# Altium schematic sheet Sheet1.SchDoc
size OrCAD D; SheetNumber: 1; SheetTotal: 1
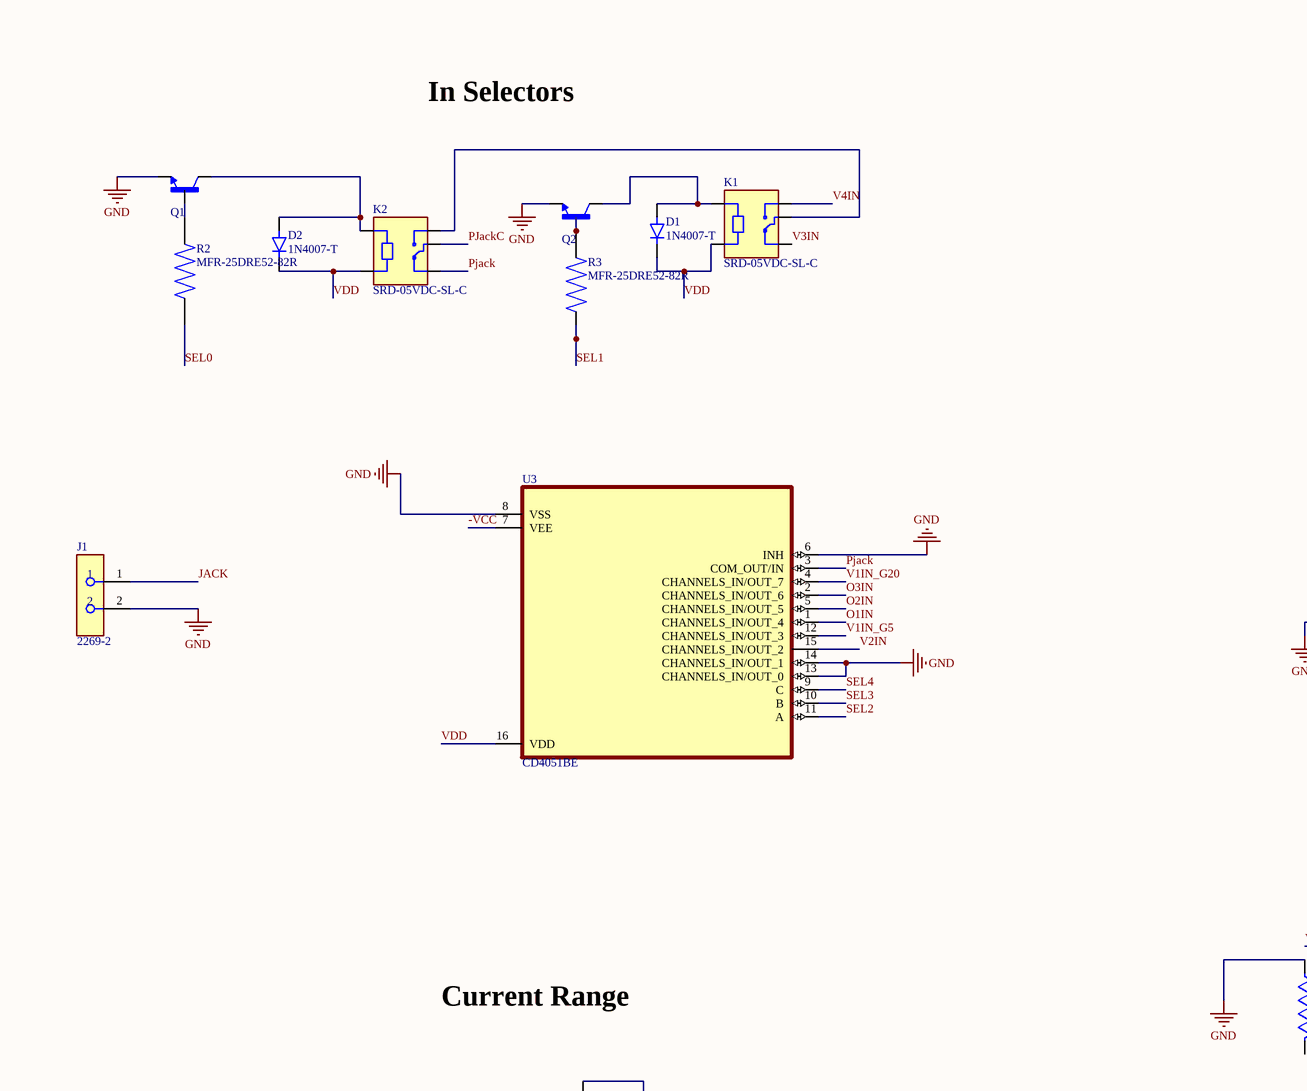
[diagram p0: Sheet1.SchDoc, top left]
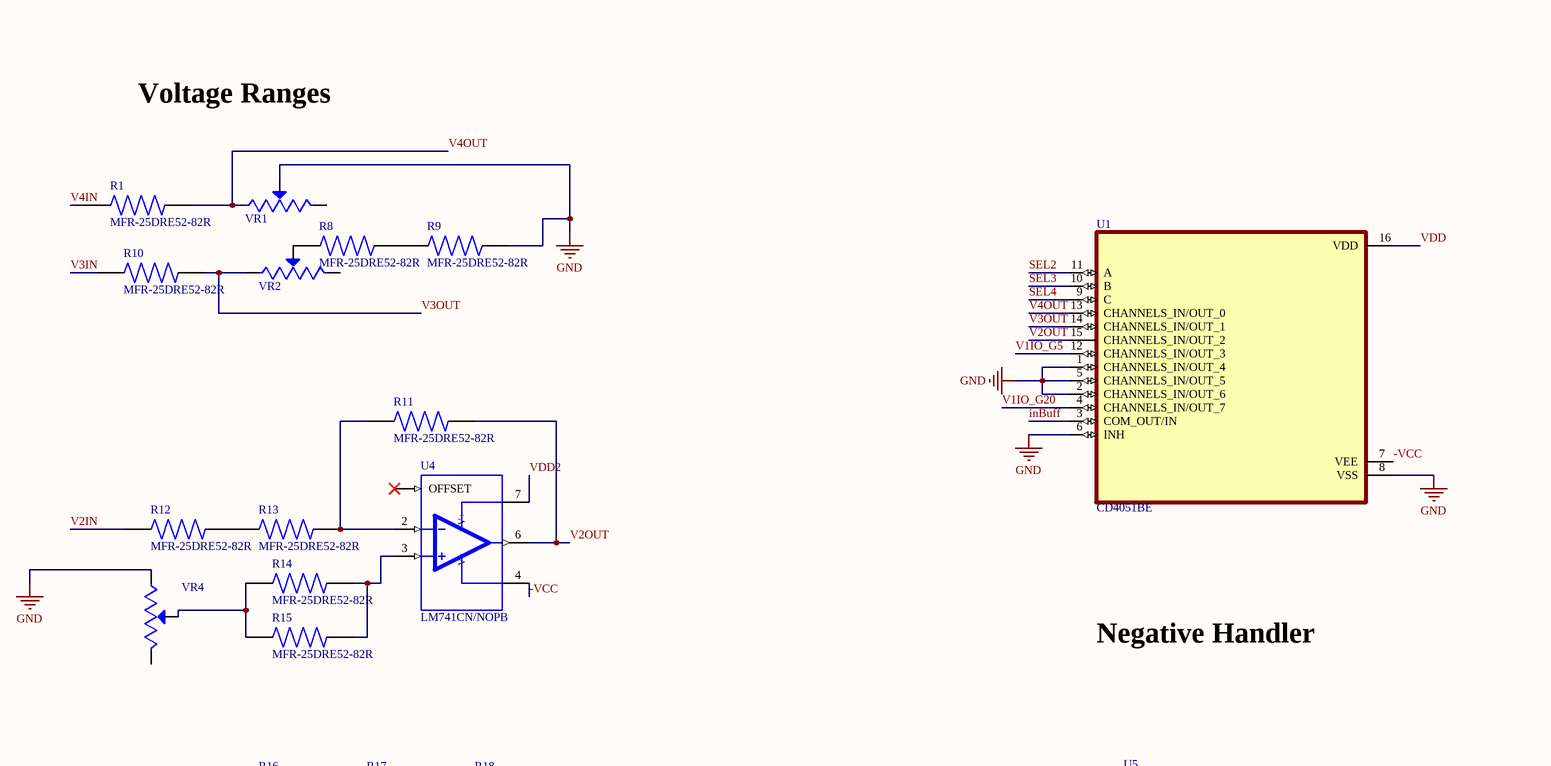
[diagram p1: Sheet1.SchDoc, top middle]
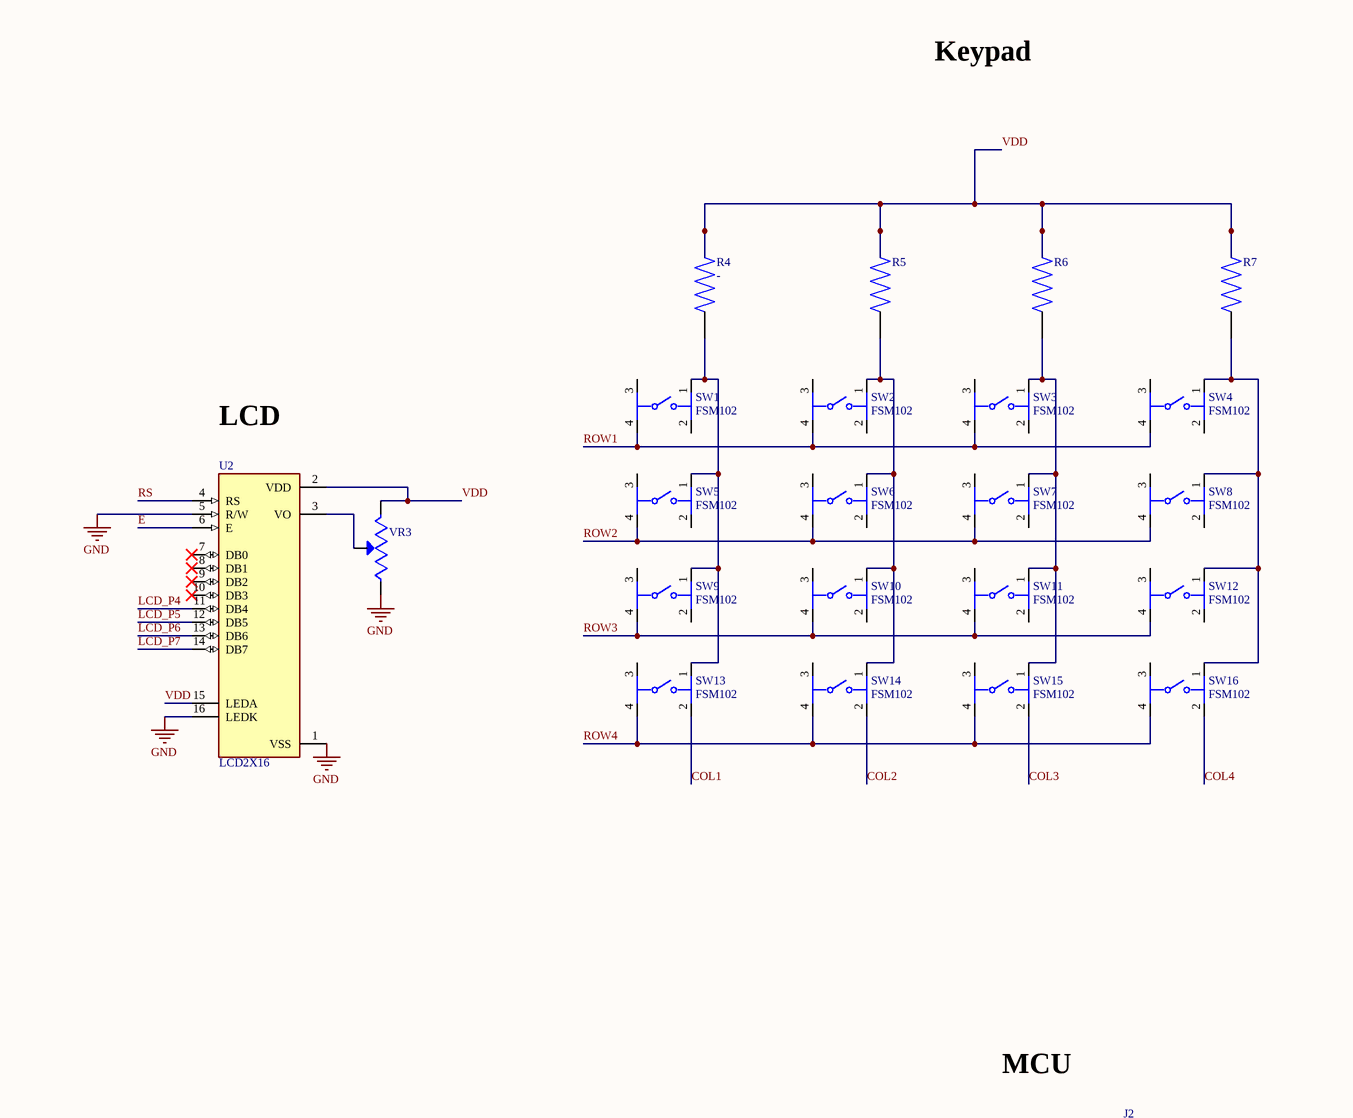
[diagram p2: Sheet1.SchDoc, top right]
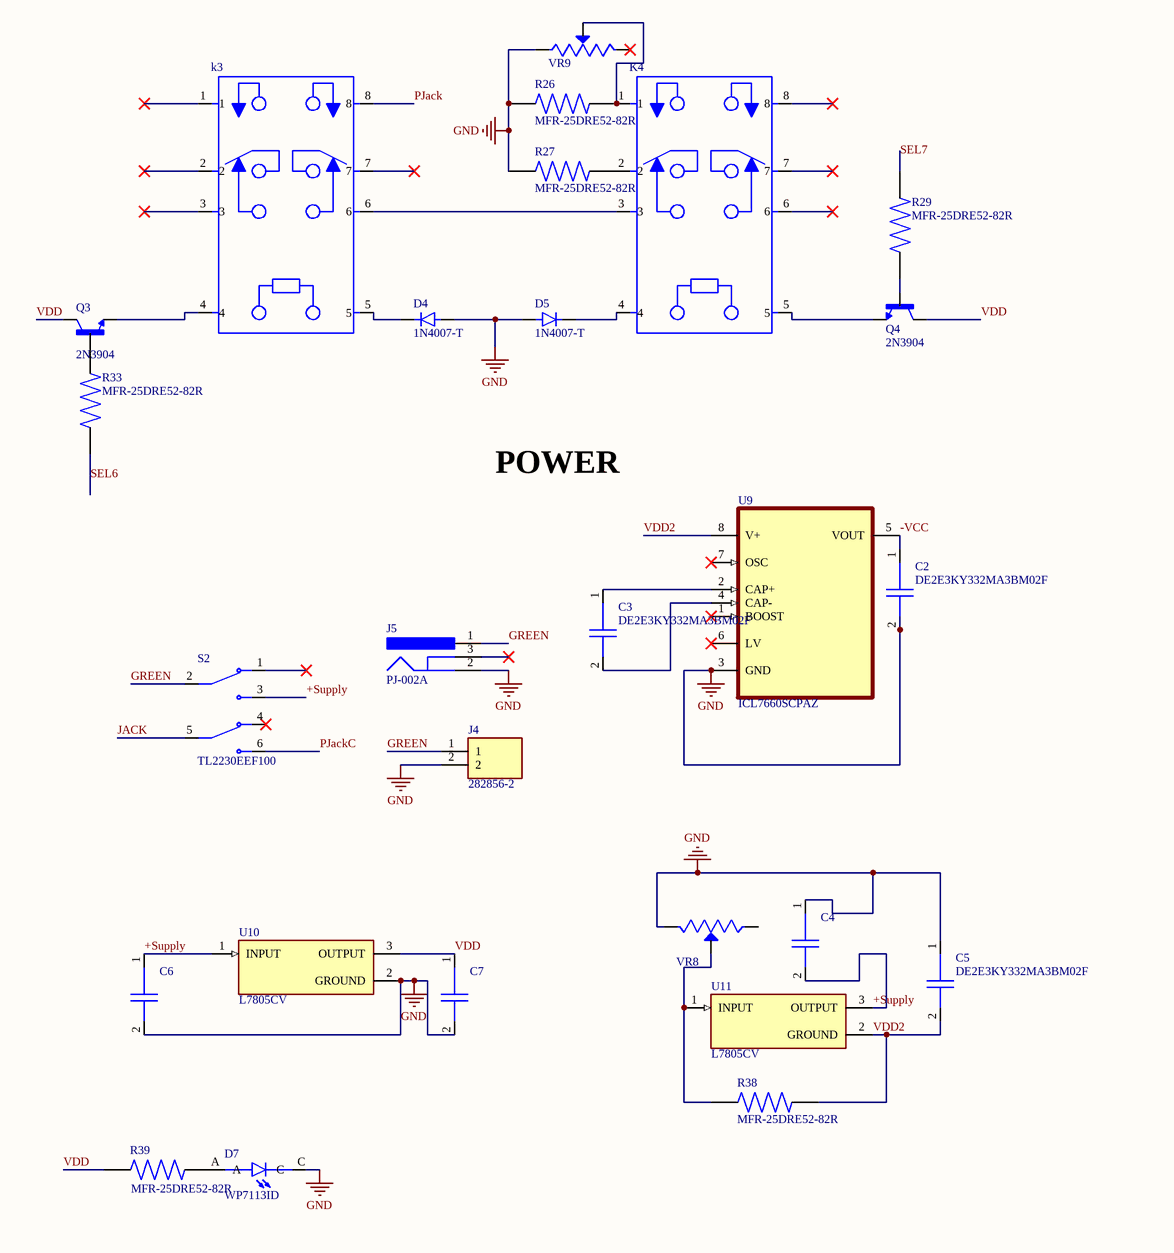
[diagram p3: Sheet1.SchDoc, bottom left]
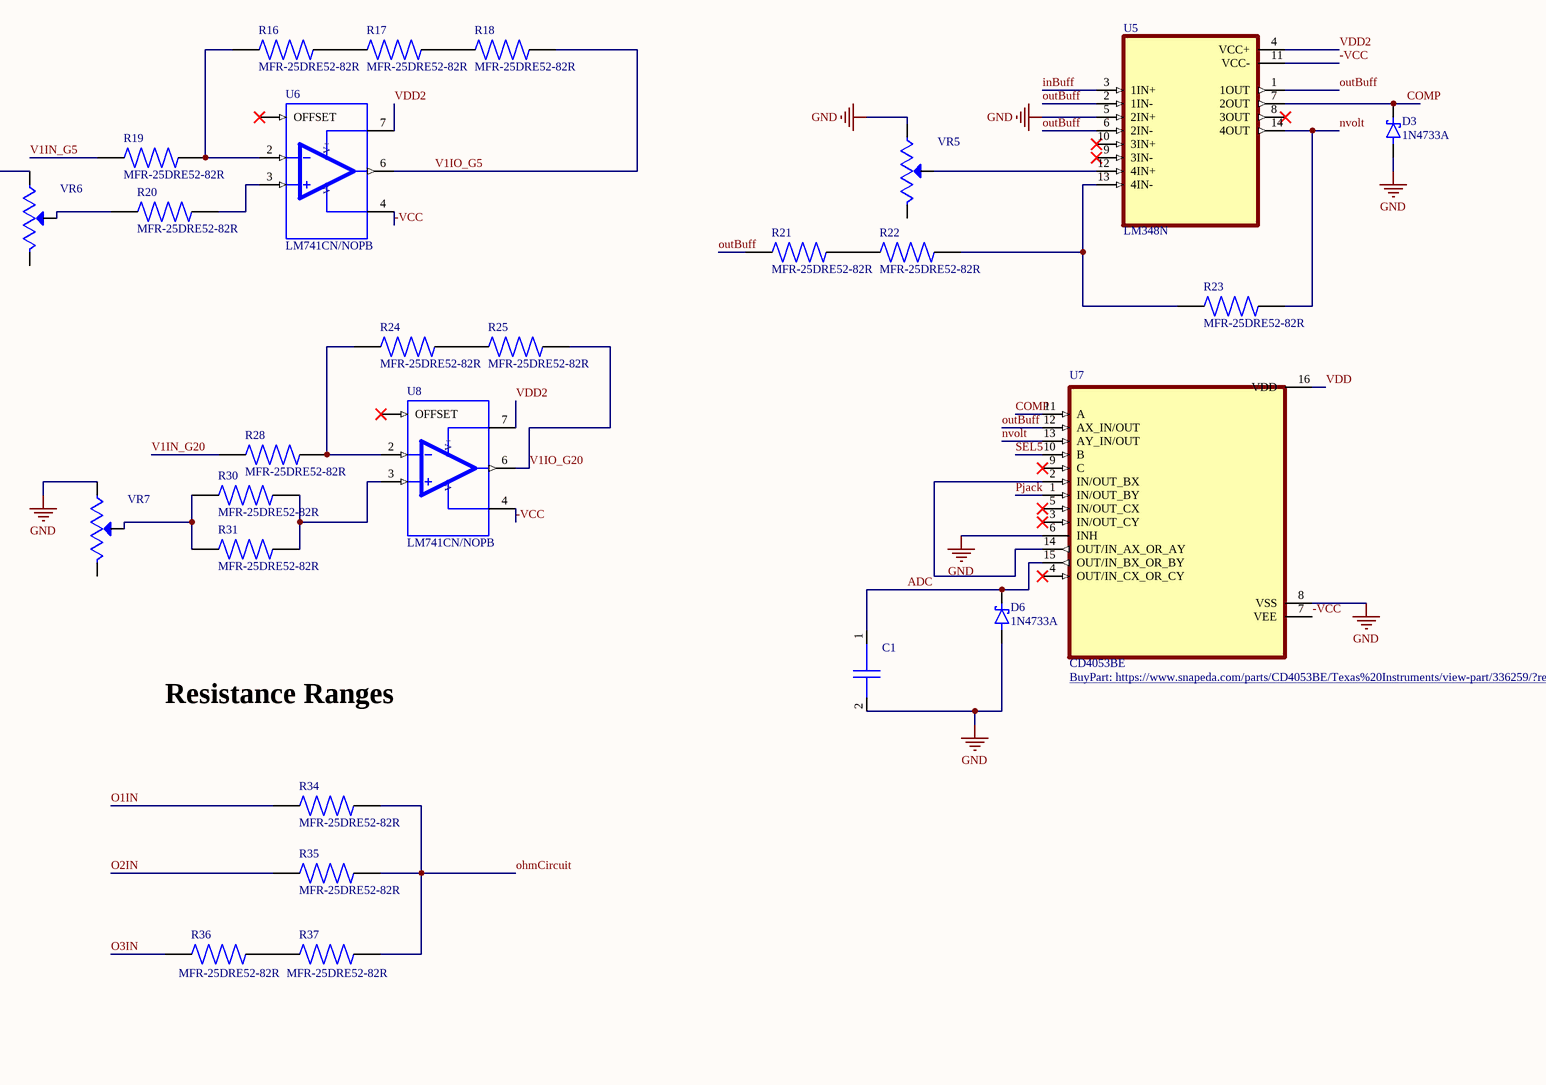
[diagram p4: Sheet1.SchDoc, bottom middle]
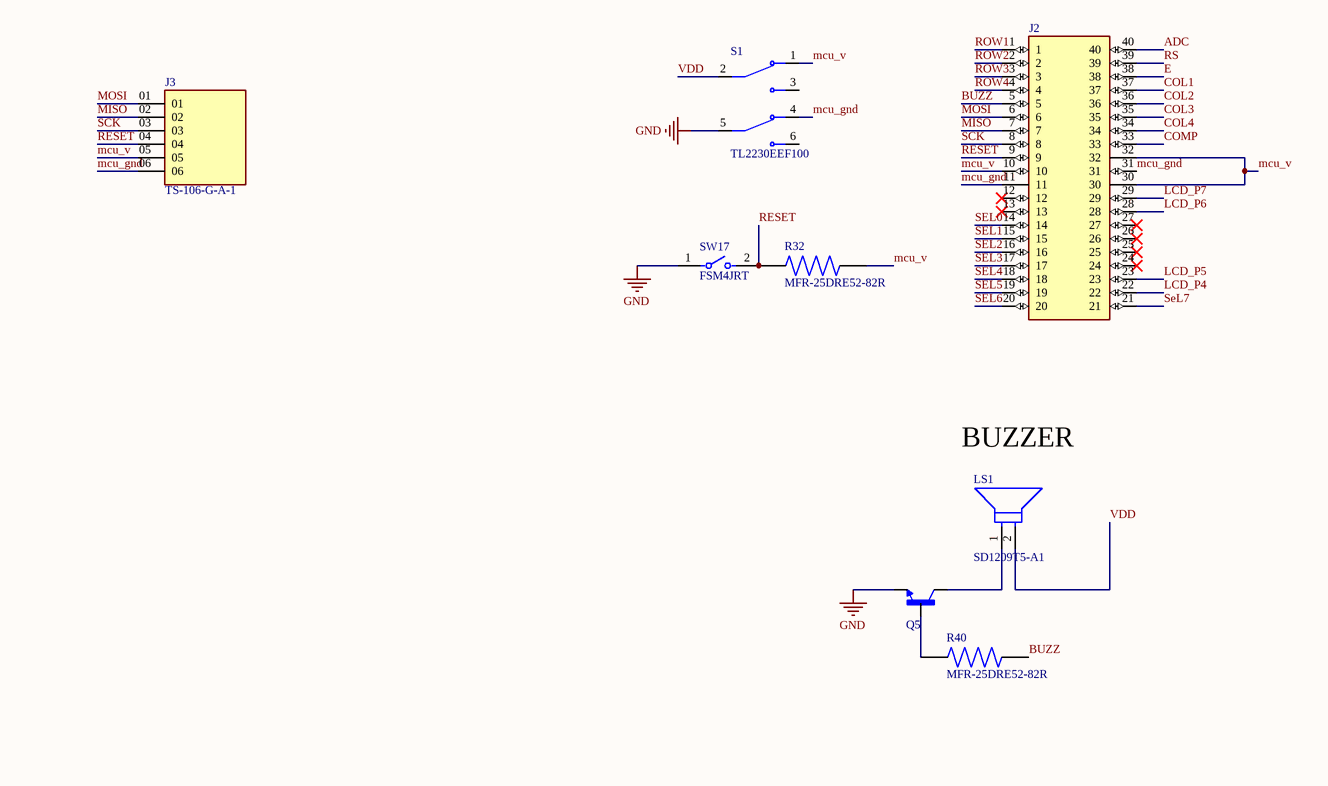
[diagram p5: Sheet1.SchDoc, bottom right]

## Parts
C1  DE2E3KY332MA3BM02F  [CAPRR750W60L900T500H900B]  (value not drawn)
C2  DE2E3KY332MA3BM02F  [CAPRR750W60L900T500H900B]
C3  DE2E3KY332MA3BM02F  [CAPRR750W60L900T500H900B]
C4  DE2E3KY332MA3BM02F  [CAPRR750W60L900T500H900B]  (value not drawn)
C5  DE2E3KY332MA3BM02F  [CAPRR750W60L900T500H900B]
C6  DE2E3KY332MA3BM02F  [CAPRR750W60L900T500H900B]  (value not drawn)
C7  DE2E3KY332MA3BM02F  [CAPRR750W60L900T500H900B]  (value not drawn)
D1  1N4007-T  [DIOAD780W78L463D236]
D2  1N4007-T  [DIOAD780W78L463D236]
D3  1N4733A  [DIOAD1036W78L463D272]
D4  1N4007-T  [DIOAD780W78L463D236]
D5  1N4007-T  [DIOAD780W78L463D236]
D6  1N4733A  [DIOAD1036W78L463D272]
D7  WP7113ID  [LED_WP7113ID]
J1  2269-2  [FP-2269-2-MFG]
J2  (no value)  [TE_3-1571552-2]
J3  TS-106-G-A-1  [SAMTEC_TS-106-G-A-1]
J4  282856-2  [TE_282856-2]
J5  PJ-002A  [CUI-PJ-002A_V]
K1  SRD-05VDC-SL-C  [RELAY_SRD-05VDC-SL-C]
K2  SRD-05VDC-SL-C  [RELAY_SRD-05VDC-SL-C]
k3  RELAY-HLS-14F3L-DC12V-C(8P-29.2X12.4MM)  [Relay (HLS-4078-DC5V)]  (value not drawn)
K4  RELAY-HLS-14F3L-DC12V-C(8P-29.2X12.4MM)  [Relay (HLS-4078-DC5V)]  (value not drawn)
LS1  SD1209T5-A1  [FP-SD1209-MFG]
Q1  2N3904  [TO92127P495H495-3]  (value not drawn)
Q2  2N3904  [TO92127P495H495-3]  (value not drawn)
Q3  2N3904  [TO92127P495H495-3]
Q4  2N3904  [TO92127P495H495-3]
Q5  2N3904  [TO92127P495H495-3]  (value not drawn)
R1  MFR-25DRE52-82R  [RESAD1520W70L1030D380]
R2  MFR-25DRE52-82R  [RESAD1520W70L1030D380]
R3  MFR-25DRE52-82R  [RESAD1520W70L1030D380]
R4  -  [RESAD1520W70L1030D380]
R5  (no value)  [RESAD1520W70L1030D380]
R6  (no value)  [RESAD1520W70L1030D380]
R7  (no value)  [RESAD1520W70L1030D380]
R8  MFR-25DRE52-82R  [RESAD1520W70L1030D380]
R9  MFR-25DRE52-82R  [RESAD1520W70L1030D380]
R10  MFR-25DRE52-82R  [RESAD1520W70L1030D380]
R11  MFR-25DRE52-82R  [RESAD1520W70L1030D380]
R12  MFR-25DRE52-82R  [RESAD1520W70L1030D380]
R13  MFR-25DRE52-82R  [RESAD1520W70L1030D380]
R14  MFR-25DRE52-82R  [RESAD1520W70L1030D380]
R15  MFR-25DRE52-82R  [RESAD1520W70L1030D380]
R16  MFR-25DRE52-82R  [RESAD1520W70L1030D380]
R17  MFR-25DRE52-82R  [RESAD1520W70L1030D380]
R18  MFR-25DRE52-82R  [RESAD1520W70L1030D380]
R19  MFR-25DRE52-82R  [RESAD1520W70L1030D380]
R20  MFR-25DRE52-82R  [RESAD1520W70L1030D380]
R21  MFR-25DRE52-82R  [RESAD1520W70L1030D380]
R22  MFR-25DRE52-82R  [RESAD1520W70L1030D380]
R23  MFR-25DRE52-82R  [RESAD1520W70L1030D380]
R24  MFR-25DRE52-82R  [RESAD1520W70L1030D380]
R25  MFR-25DRE52-82R  [RESAD1520W70L1030D380]
R26  MFR-25DRE52-82R  [RESAD1520W70L1030D380]
R27  MFR-25DRE52-82R  [RESAD1520W70L1030D380]
R28  MFR-25DRE52-82R  [RESAD1520W70L1030D380]
R29  MFR-25DRE52-82R  [RESAD1520W70L1030D380]
R30  MFR-25DRE52-82R  [RESAD1520W70L1030D380]
R31  MFR-25DRE52-82R  [RESAD1520W70L1030D380]
R32  MFR-25DRE52-82R  [RESAD1520W70L1030D380]
R33  MFR-25DRE52-82R  [RESAD1520W70L1030D380]
R34  MFR-25DRE52-82R  [RESAD1520W70L1030D380]
R35  MFR-25DRE52-82R  [RESAD1520W70L1030D380]
R36  MFR-25DRE52-82R  [RESAD1520W70L1030D380]
R37  MFR-25DRE52-82R  [RESAD1520W70L1030D380]
R38  MFR-25DRE52-82R  [RESAD1520W70L1030D380]
R39  MFR-25DRE52-82R  [RESAD1520W70L1030D380]
R40  MFR-25DRE52-82R  [RESAD1520W70L1030D380]
S1  TL2230EEF100  [SW_TL2230EEF100]
S2  TL2230EEF100  [SW_TL2230EEF100]
SW1  FSM102  [FP-FSM102-MFG]
SW2  FSM102  [FP-FSM102-MFG]
SW3  FSM102  [FP-FSM102-MFG]
SW4  FSM102  [FP-FSM102-MFG]
SW5  FSM102  [FP-FSM102-MFG]
SW6  FSM102  [FP-FSM102-MFG]
SW7  FSM102  [FP-FSM102-MFG]
SW8  FSM102  [FP-FSM102-MFG]
SW9  FSM102  [FP-FSM102-MFG]
SW10  FSM102  [FP-FSM102-MFG]
SW11  FSM102  [FP-FSM102-MFG]
SW12  FSM102  [FP-FSM102-MFG]
SW13  FSM102  [FP-FSM102-MFG]
SW14  FSM102  [FP-FSM102-MFG]
SW15  FSM102  [FP-FSM102-MFG]
SW16  FSM102  [FP-FSM102-MFG]
SW17  FSM4JRT  [FP-FSM4JRT-MFG]
U1  CD4051BE  [DIP794W45P254L1969H508Q16 - duplicate]
U2  LCD2X16  [LCD_LCD2X16]
U3  CD4051BE  [DIP794W45P254L1969H508Q16 - duplicate]
U4  LM741CN/NOPB  [DIP794W45P254L1016H508Q8]
U5  LM348N  [DIP14]
U6  LM741CN/NOPB  [DIP794W45P254L1016H508Q8]
U7  CD4053BE  [DIP794W45P254L1969H508Q16 - duplicate]
U8  LM741CN/NOPB  [DIP794W45P254L1016H508Q8]
U9  ICL7660SCPAZ  [DIP254P762X533-8]
U10  L7805CV  [TO255P1040X460X1968-3]
U11  L7805CV  [TO255P1040X460X1968-3]
VR1  3296W1103LF  [TRIM_3296W1103LF]  (value not drawn)
VR2  3296W1103LF  [TRIM_3296W1103LF]  (value not drawn)
VR3  3296W1103LF  [TRIM_3296W1103LF]  (value not drawn)
VR4  3296W1103LF  [TRIM_3296W1103LF]  (value not drawn)
VR5  3296W1103LF  [TRIM_3296W1103LF]  (value not drawn)
VR6  3296W1103LF  [TRIM_3296W1103LF]  (value not drawn)
VR7  3296W1103LF  [TRIM_3296W1103LF]  (value not drawn)
VR8  3296W1103LF  [TRIM_3296W1103LF]  (value not drawn)
VR9  3296W1103LF  [TRIM_3296W1103LF]  (value not drawn)

## Nets
GND: C1.2 C2.2 C4.1 C5.1 C6.2 C7.2 D3.2(A) D4.A D5.A D6.2(A) D7.C J1.2 J4.2 J5.2 Q1.1(E) Q2.1(E) Q5.1(E) R9.2 R26.1 R27.1 S1.5(COM2) SW17.1 U1.1(CHANNELS_IN/OUT_4) U1.2(CHANNELS_IN/OUT_6) U1.5(CHANNELS_IN/OUT_5) U1.6(INH) U1.8(VSS) U2.1(VSS) U2.5(R/W) U2.16(LEDK) U3.6(INH) U3.8(VSS) U3.13(CHANNELS_IN/OUT_0) U3.14(CHANNELS_IN/OUT_1) U5.5(2IN+) U7.6(INH) U7.8(VSS) U9.3(GND) U10.2(GROUND) VR1.2(WIPER) VR3.1(CCW) VR4.1(CCW) VR5.1(CCW) VR6.1(CCW) VR7.1(CCW) VR8.3(CW) VR9.1(CCW)
+Supply: C4.2 C6.1 S2.3(NO1) U10.1(INPUT) U11.3(OUTPUT)
-VCC: C2.1 U1.7(VEE) U3.7(VEE) U4.4(V-) U5.11(VCC-) U6.4(V-) U7.7(VEE) U8.4(V-) U9.5(VOUT)  [also labelled \]
ADC: C1.1 D6.1(K) J2.40 U7.15(OUT/IN_BX_OR_BY)
BUZZ: J2.5 R40.2
COL1: J2.37 SW13.2
COL2: J2.36 SW14.2
COL3: J2.35 SW15.2
COL4: J2.34 SW16.2
COMP: D3.1(K) J2.33 U5.7(2OUT) U7.11(A)
E: J2.38 U2.6(E)
GREEN: J4.1 J5.1 S2.2(COM1)
inBuff: U1.3(COM_OUT/IN) U5.3(1IN+)
JACK: J1.1 S2.5(COM2)
LCD_P4: J2.22 U2.11(DB4)
LCD_P5: J2.23 U2.12(DB5)
LCD_P6: J2.28 U2.13(DB6)
LCD_P7: J2.29 U2.14(DB7)
mcu_gnd: J2.11 J2.31 J3.06 S1.4(NC2)
mcu_v: J2.10 J2.30 J2.32 J3.05 R32.2 S1.1(NC1)
MISO: J2.7 J3.02
MOSI: J2.6 J3.01
nvolt: R23.2 U5.14(4OUT) U7.13(AY_IN/OUT)
O1IN: R34.1 U3.1(CHANNELS_IN/OUT_4)
O2IN: R35.1 U3.5(CHANNELS_IN/OUT_5)
O3IN: R36.1 U3.2(CHANNELS_IN/OUT_6)
ohmCircuit: R34.2 R35.2 R37.2
outBuff: R21.1 U5.1(1OUT) U5.2(1IN-) U5.6(2IN-) U7.12(AX_IN/OUT)
PJack: K2.NC k3.8 U3.3(COM_OUT/IN) U7.1(IN/OUT_BY)
PJackC: K2.COM S2.6(NO2)
RESET: J2.9 J3.04 R32.1 SW17.2
ROW1: J2.1 SW1.4 SW2.4 SW3.4 SW4.4
ROW2: J2.2 SW5.4 SW6.4 SW7.4 SW8.4
ROW3: J2.3 SW9.4 SW10.4 SW11.4 SW12.4
ROW4: J2.4 SW13.4 SW14.4 SW15.4 SW16.4
RS: J2.39 U2.4(RS)
SCK: J2.8 J3.03
SEL0: J2.14 R2.2
SEL1: J2.15 R3.2
SEL2: J2.16 U1.11(A) U3.11(A)
SEL3: J2.17 U1.10(B) U3.10(B)
SEL4: J2.18 U1.9(C) U3.9(C)
SEL5: J2.19 U7.10(B)
SEL6: J2.20 R33.1
SEL7: J2.21 R29.2
V1IN_G5: R19.1 U3.12(CHANNELS_IN/OUT_3)
V1IN_G20: R28.1 U3.4(CHANNELS_IN/OUT_7)
V1IO_G5: R18.2 U1.12(CHANNELS_IN/OUT_3) U6.6(OUTPUT)
V1IO_G20: R25.2 U1.4(CHANNELS_IN/OUT_7) U8.6(OUTPUT)
V2IN: R12.1 U3.15(CHANNELS_IN/OUT_2)
V2OUT: R11.2 U1.15(CHANNELS_IN/OUT_2) U4.6(OUTPUT)
V3IN: K1.NC R10.1
V3OUT: R10.2 U1.14(CHANNELS_IN/OUT_1) VR2.1(CCW)
V4IN: K1.NO R1.1
V4OUT: R1.2 U1.13(CHANNELS_IN/OUT_0) VR1.1(CCW)
VDD: C7.1 D1.K D2.K K1.A2 K2.A2 LS1.2(A) Q3.3(C) Q4.3(C) R4.2 R5.2 R6.2 R7.2 R39.2 S1.2(COM1) U1.16(VDD) U2.2(VDD) U2.15(LEDA) U3.16(VDD) U7.16(VDD) U10.3(OUTPUT) VR3.3(CW)
VDD2: C5.2 R38.1 U4.7(V+) U5.4(VCC+) U6.7(V+) U8.7(V+) U9.8(V+) U11.2(GROUND)
NetC3_1: C3.1 U9.2(CAP+)
NetC3_2: C3.2 U9.4(CAP-)
NetD1_A: D1.A K1.A1 Q2.3(C)
NetD2_A: D2.A K2.A1 Q1.3(C)
NetD4_K: D4.K k3.5
NetD5_K: D5.K K4.4
NetD7_A: D7.A R39.1
NetK1_COM: K1.COM K2.NO
Netk3_4: k3.4 Q3.1(E)
Netk3_6: k3.6 K4.3
NetK4_1: K4.1 R26.2 VR9.2(WIPER)
NetK4_2: K4.2 R27.2
NetK4_5: K4.5 Q4.1(E)
NetLS1_1: LS1.1(C) Q5.3(C)
NetQ1_2: Q1.2(B) R2.1
NetQ2_2: Q2.2(B) R3.1
NetQ3_2: Q3.2(B) R33.2
NetQ4_2: Q4.2(B) R29.1
NetQ5_2: Q5.2(B) R40.1
NetR4_1: R4.1 SW1.1 SW5.1 SW9.1 SW13.1
NetR5_1: R5.1 SW2.1 SW6.1 SW10.1 SW14.1
NetR6_1: R6.1 SW3.1 SW7.1 SW11.1 SW15.1
NetR7_1: R7.1 SW4.1 SW8.1 SW12.1 SW16.1
NetR8_1: R8.1 VR2.2(WIPER)
NetR8_2: R8.2 R9.1
NetR11_1: R11.1 R13.2 U4.2(INV_INPUT)
NetR12_2: R12.2 R13.1
NetR14_1: R14.1 R15.1 VR4.2(WIPER)
NetR14_2: R14.2 R15.2 U4.3(NON-INV_INPUT)
NetR16_1: R16.1 R19.2 U6.2(INV_INPUT)
NetR16_2: R16.2 R17.1
NetR17_2: R17.2 R18.1
NetR20_1: R20.1 VR6.2(WIPER)
NetR20_2: R20.2 U6.3(NON-INV_INPUT)
NetR21_2: R21.2 R22.1
NetR22_2: R22.2 R23.1 U5.13(4IN-)
NetR24_1: R24.1 R28.2 U8.2(INV_INPUT)
NetR24_2: R24.2 R25.1
NetR30_1: R30.1 R31.1 VR7.2(WIPER)
NetR30_2: R30.2 R31.2 U8.3(NON-INV_INPUT)
NetR36_2: R36.2 R37.1
NetR38_2: R38.2 U11.1(INPUT) VR8.2(WIPER)
NetU2_3: U2.3(VO) VR3.2(WIPER)
NetU4_1: U4.1(OFFSET) U4.5(OFFSET)
NetU5_12: U5.12(4IN+) VR5.2(WIPER)
NetU6_1: U6.1(OFFSET) U6.5(OFFSET)
NetU7_2: U7.2(IN/OUT_BX) U7.14(OUT/IN_AX_OR_AY)
NetU8_1: U8.1(OFFSET) U8.5(OFFSET)

Not connected (* = marked no-connect by the designer): J2 12* 13* 24* 25* 26* 27*; J5 3*; k3 1* 2* 3* 7*; K4 6* 7* 8*; S1 3(NO1) 6(NO2); S2 1(NC1)* 4(NC2)*; SW1 2 3; SW2 2 3; SW3 2 3; SW4 2 3; SW5 2 3; SW6 2 3; SW7 2 3; SW8 2 3; SW9 2 3; SW10 2 3; SW11 2 3; SW12 2 3; SW13 3; SW14 3; SW15 3; SW16 3; U2 7(DB0)* 8(DB1)* 9(DB2)* 10(DB3)*; U5 8(3OUT)* 9(3IN-)* 10(3IN+)*; U7 3(IN/OUT_CY)* 4(OUT/IN_CX_OR_CY)* 5(IN/OUT_CX)* 9(C)*; U9 1(BOOST)* 6(LV)* 7(OSC)*; VR1 3(CW); VR2 3(CW); VR4 3(CW); VR5 3(CW); VR6 3(CW); VR7 3(CW); VR8 1(CCW); VR9 3(CW)*

## Notes on the sheet
- In Selectors
- Keypad
- Voltage Ranges
- LCD
- Negative Handler
- Current Range
- MCU
- Resistance Ranges
- POWER
- BUZZER

## Library data of the parts
C1-C7 = DE2E3KY332MA3BM02F: Cap Ceramic 0.0033uF 250VAC E 20% (9 X 5mm) Radial 7.5mm 125Â°C Bulk; Package: None; Price: None; Value: *; MP: DE2E3KY332MA3BM02F; Availability: Unavailable
D1 D2 D4 D5 = 1N4007-T: Diode Standard 1A 1000V 1Vf DO41 | Diodes Inc 1N4007-T; MF: Diodes Incorporated; SnapEDA_Link: https://www.snapeda.com/parts/1N4007-T/Diodes+Inc./view-part/?ref=snap; Package: DO-41 Diodes Inc.; Value: *; MP: 1N4007-T; Check_prices: https://www.snapeda.com/parts/1N4007-T/Diodes+Inc./view-part/?ref=eda
D3 D6 = 1N4733A: Zener Diode 5.1 V 1 W Â±5% Through Hole DO-41; MF: onsemi; SnapEDA_Link: https://www.snapeda.com/parts/1N4733A/Onsemi/view-part/?ref=snap; Package: DO-41 ON Semiconductor; Value: *; MP: 1N4733A; Check_prices: https://www.snapeda.com/parts/1N4733A/Onsemi/view-part/?ref=eda
D7 = WP7113ID: Red 617nm LED Indication - Discrete 2V Radial; MF: Kingbright; Price: None; MP: WP7113ID; Package: Radial Kingbright; Check_prices: https://www.snapeda.com/parts/WP7113ID/Kingbright/view-part/?ref=eda; Purchase-URL: https://pricing.snapeda.com/search/part/WP7113ID/?ref=eda; Availability: In Stock; Value: *; SnapEDA_Link: https://www.snapeda.com/parts/WP7113ID/Kingbright/view-part/?ref=snap
J1 = CMP-73906-000010-1_1: CONN DBL BANANA JACK TURRET; Voltage Rating (DC): 70V; Max Current Rating: 15A; Number of Contacts: 2; Voltage Rating: 2.5kV; Body Material: PC; Gender: Female; Insulation: Mating End Insulated; Housing Color: Red; Insulation Material: Polycarbonate; Contact Material: Brass; Termination: Solder; Height: 0.375inch; Orientation: Straight; Lead Free: Lead Free; Length: 24inch; Depth: 16mm; Current Rating: 15A; Width: 4inch; Contact Plating: Tin; Weight: 0.033lb; RoHS Compliant: Yes; REACH SVHC: No SVHC; Package Quantity: 5; Number of Ports: 2; Color: Red; Housing Material: Polycarbonate; Packaging: Bulk; Mount: Panel
J2 = 3-1571552-2: Row Spacing 2.54 mm Pitch Through Hole Dip Socket; Package: None; Price: None; Value: *; MP: 3-1571552-2; Availability: Unavailable
J3 = TS-106-G-A-1: Conn Unshrouded Header HDR 6 POS 2.54mm Solder ST Thru-Hole Tube; MF: Samtec; Value: *; Availability: In Stock; Purchase-URL: https://pricing.snapeda.com/search/part/TS-106-G-A-1/?ref=eda; Price: None; SnapEDA_Link: https://www.snapeda.com/parts/TS-106-G-A-1/Samtec/view-part/?ref=snap; Check_prices: https://www.snapeda.com/parts/TS-106-G-A-1/Samtec/view-part/?ref=eda; Package: None; MP: TS-106-G-A-1
J4 = 282856-2: TERMI-BLOK PCB MOUNT 2P; MF: TE Connectivity; Purchase-URL: https://pricing.snapeda.com/search/part/282856-2/?ref=eda; Package: None; MP: 282856-2; EU_RoHS_Compliance: Compliant with Exemptions; Price: None; Availability: In Stock; Value: *; Check_prices: https://www.snapeda.com/parts/282856-2/TE+Connectivity+AMP+Connectors/view-part/?ref=eda; SnapEDA_Link: https://www.snapeda.com/parts/282856-2/TE+Connectivity+AMP+Connectors/view-part/?ref=snap
J5 = CMP-2000-06895-2: Through Hole Right Angle DC Power Jack, 2.5 A, 2 mm Center Pin, 3 Position, -25 to 85 degC, RoHS, Bulk; Manufacturer: CUIInc.; Brand: CUI; Inside Contact Diameter: 2mm; Voltage Rating: 24V; Outside Contact Diameter: 6.5mm; Current Rating: 2.5A; Insulation Resistance: 50MOhms; Contact Gender: Male; Connector Type: DCPowerJack; Datasheet Version: Rev. 1.03, 04/2016; Housing Material: PolybutyleneTerephthalate(PBT); Operating Temperature Range: -25Cto+85C; Termination Style: ThroughHole; Product Category: DCPowerConnectors; Mounting Technology: ThroughHole; Mounting Style: ThroughHole; Factory Pack Quantity: 500; Contact Plating: Nickel; Package Reference: PJ-002A; Mounting Angle: Right; Package Description: 3-Pin Through Hole Device, Body 14.4 x 9 mm, Height 11 mm; Flammability Rating: UL94V-0; Manufacturer URL: http://www.cui.com/; Product: Jacks; Contact Material: Copper; Datasheet URL: http://www.cui.com/product/resource/pj-002a.pdf; RoHS: True
K1 K2 = SRD-05VDC-SL-C: 5V Trigger Relay Module For Arduino And Raspberry Pi 5V Trigger Relay Module For Arduino And Raspberry Pi; MF: Songle Relay; Check_prices: https://www.snapeda.com/parts/SRD-05VDC-SL-C/Songle+Relay/view-part/?ref=eda; Value: *; Availability: Not in stock; Price: None; Package: NON STANDARD-5 Songle Relay; MP: SRD-05VDC-SL-C; SnapEDA_Link: https://www.snapeda.com/parts/SRD-05VDC-SL-C/Songle+Relay/view-part/?ref=snap
k3 K4 = RELAY-HLS-14F3L-DC12V-C(8P-29.2X12.4MM): Relay-12V-5A/240VAC;; MF: Helishun; Availability: Unavailable; SnapEDA_Link: https://www.snapeda.com/parts/HLS-14F3L-DC12V-C/Helishun/view-part/105888/?ref=snap; MP: HLS-14F3L-DC12V-C; Value: *; Price: None; Package: None
LS1 = CMP-08413-000009-1: AUDIO MAGNETIC XDCR 3-6V TH; Max Supply Current: 60mA; Number of Terminals/Pins: 2; Frequency: 2.048kHz; Washable: No; Operating Supply Voltage: 5V; Self Resonant Frequency: 2.05kHz; Min Operating Temperature: -40°C; Operating Supply Current: 60mA; Diameter: 12mm; Package Quantity: 100; Max Operating Temperature: 85°C; Sensing Method: Magnetic; Series: SD; Current Rating: 60mA; Lead Free: Lead Free; Height: 9mm; Packaging: Tray; Termination: PC Pins; Number of Pins: 2; Voltage Rating (DC): 5V; Mount: Through Hole
Q1-Q5 = 2N3904: TRANS NPN 40V 200MA TO92-3; MF: Rectron; SnapEDA_Link: https://www.snapeda.com/parts/2N3904/Rectron/view-part/?ref=snap; Package: TO-226-3 Rectron; MP: 2N3904; Check_prices: https://www.snapeda.com/parts/2N3904/Rectron/view-part/?ref=eda; Purchase-URL: https://pricing.snapeda.com/search/part/2N3904/?ref=eda; Price: None; Value: *; Availability: In Stock
R1-R40 = MFR-25DRE52-82R: RES 280K OHM 1/4W 1% AXIAL; Package: None; Price: None; Value: *; MP: MFR-25DRE52-82R; Availability: Unavailable
S1 S2 = TL2230EEF100: Pushbutton Switch DPDT Standard Through Hole; MF: E-Switch; Price: None; SnapEDA_Link: https://www.snapeda.com/parts/TL2230EEF100/E-Switch/view-part/?ref=snap; MP: TL2230EEF100; Purchase-URL: https://pricing.snapeda.com/search/part/TL2230EEF100/?ref=eda; Value: *; Availability: In Stock; Package: None; Check_prices: https://www.snapeda.com/parts/TL2230EEF100/E-Switch/view-part/?ref=eda
SW1-SW16 = push button: SWITCH TACTILE SPST-NO 0.05A 24V; Contact Current Rating: 50mA; Switch Travel: 0.3mm; Actuator Material: Polyester; Actuator Length: 8.02mm; Contact Resistance: 100mR; Operating Force: 160gf; Throw Configuration: SPST; Electrical Life: 100000Cycles; Max Voltage Rating (DC): 12V; Switch Function: Off-Mom; Illumination Type: Non-Illuminated; Color: Black; Type: Switch; Termination: PC Pin; Package Quantity: 400; Min Operating Temperature: -40°C; Max Current Rating: 50mA; Lead Free: Lead Free; Series: FSM100 ~ 104; Width: 12.4mm; Mount: Through Hole; ELV: Compliant; Contact Material: Copper Alloy; Voltage Rating (DC): 24V; Length: 12.4mm; Contact Plating: Silver; RoHS Compliant: Yes; Mechanical Life: 100000Cycles; Packaging: Loose Piece; Orientation: Straight; Height: 3.99mm; Current Rating: 50mA; Max Operating Temperature: 85°C; Depth: 12.5mm
SW17 = CMP-03407-000038-1: SWITCH TACTILE SPST-NO 0.05A 24V; Current Rating: 50mA; Actuator Diameter: 3.5mm; Max Voltage Rating (DC): 12V; Actuator Length: 0.055inch; Switch Travel: 0.25mm; Actuator Type: Standard; Contact Resistance: 100mR; Illumination Type: Non-Illuminated; Electrical Life: 100000Cycles; Throw Configuration: SPST; Switch Function: Off-Mom; Actuator Material: Resin; Operating Force: 1.57N; Series: FSMJRT; Min Operating Temperature: -35°C; Max Current Rating: 50mA; Termination: PC Pins; Type: Switch; Radiation Hardening: No; Max Operating Temperature: 105°C; Voltage Rating (DC): 12V; Contact Material: Copper Alloy; Contact Current Rating: 50mA; RoHS Compliant: Yes; Mechanical Life: 100000Cycles; Mount: Through Hole; Package Quantity: 10000; Case/Package: Radial; Packaging: Tape and Reel; Length: 6.19mm; Contact Plating: Silver; Depth: 6.19mm; Orientation: Straight
U1 U3 = CD4051BE: 20-V, 8:1, 1-channel analog multiplexer with logic-level conversion; MF: Texas Instruments; MP: CD4051BE; Price: None; Package: PDIP-16 Texas Instruments; Availability: In Stock; SnapEDA_Link: https://www.snapeda.com/parts/CD4051BE/Texas+Instruments/view-part/?ref=snap; Value: *; Check_prices: https://www.snapeda.com/parts/CD4051BE/Texas+Instruments/view-part/?ref=eda; Purchase-URL: https://pricing.snapeda.com/search/part/CD4051BE/?ref=eda
U2 = LCD2X16: Display; Display: LCD 2x16 characters (blue backlight); Price: None; Value: *; MP: LCD2X16; Package: None; Availability: Unavailable
U4 U6 U8 = LM741CN/NOPB: General Purpose Amplifier 1 Circuit 8-PDIP; MF: Texas Instruments; Package: DIP-8 Microsemi; Value: *; Price: None; MP: LM741CN/NOPB; Availability: Unavailable; SnapEDA_Link: https://www.snapeda.com/parts/LM741CN/NOPB/Texas%20Instruments/view-part/74633/?ref=snap
U5 = LM348N: Quad general propÃ³sito 36V amplificador operacional 14-PDIP 0 a 70; MF: Texas Instruments; Price: None; Value: *; MP: LM348N; Package: PDIP-14 Texas Instruments; Purchase-URL: https://pricing.snapeda.com/search/part/LM348N/?ref=eda; SnapEDA_Link: https://www.snapeda.com/parts/LM348N/Texas%20Instruments/view-part/4791540/?ref=snap; Check_prices: https://www.snapeda.com/parts/LM348N/Texas%20Instruments/view-part/4791540/?ref=eda; Availability: Warning
U7 = CD4053BE: 20-V, 2:1 (SPDT), 3-channel analog multiplexer with logic-level conversion 16-PDIP -55 to 125; MF: Texas Instruments; MP: CD4053BE; DigiKey-Purchase-URL: https://snapeda.com/shop?store=DigiKey&id=336259; SnapEDA_Link: https://www.snapeda.com/parts/CD4053BE/Texas%20Instruments/view-part/336259/?ref=snap; Availability: Good; Arrow_Electronics-Purchase-URL: https://snapeda.com/shop?store=Arrow+Electronics&id=336259; Mouser-Purchase-URL: https://snapeda.com/shop?store=Mouser&id=336259; Package: PDIP-16 Texas Instruments; Texas_Instruments-Purchase-URL: https://snapeda.com/shop?store=Texas+Instruments&id=336259; Value: *; Price: None; BuyPart: https://www.snapeda.com/parts/CD4053BE/Texas%20Instruments/view-part/336259/?ref=eda
U9 = ICL7660SCPAZ: Charge Pump Switching Regulator IC Positive or Negative Fixed -Vin, 2Vin 1 Output 45mA 8-DIP (0.300, 7.62mm); MF: Renesas Electronics America Inc; Check_prices: https://www.snapeda.com/parts/ICL7660SCPAZ/Renesas/view-part/?ref=eda; Value: *; Availability: In Stock; MP: ICL7660SCPAZ; Price: None; Package: DIP-8 Renesas / Intersil; SnapEDA_Link: https://www.snapeda.com/parts/ICL7660SCPAZ/Renesas/view-part/?ref=snap; Purchase-URL: https://pricing.snapeda.com/search/part/ICL7660SCPAZ/?ref=eda
U10 U11 = L7805CV: Linear Voltage Regulator IC Positive Fixed 1 Output 1.5A TO-220; MF: STMicroelectronics; SnapEDA_Link: https://www.snapeda.com/parts/L7805CV/STMicroelectronics/view-part/?ref=snap; Package: TO-220-3 ON Semiconductor; MP: L7805CV; Check_prices: https://www.snapeda.com/parts/L7805CV/STMicroelectronics/view-part/?ref=eda; Purchase-URL: https://pricing.snapeda.com/search/part/L7805CV/?ref=eda; Price: None; Value: *; Availability: In Stock
VR1-VR9 = 3296W1103LF: Trimmer, Potentiometer 10kohm 25turn Thd; MF: Bourns; Package: None; MP: 3296W1103LF; Check_prices: https://www.snapeda.com/parts/3296W1103LF/Bourns/view-part/2487625/?ref=eda; Availability: Unavailable; Price: None; SnapEDA_Link: https://www.snapeda.com/parts/3296W1103LF/Bourns/view-part/2487625/?ref=snap